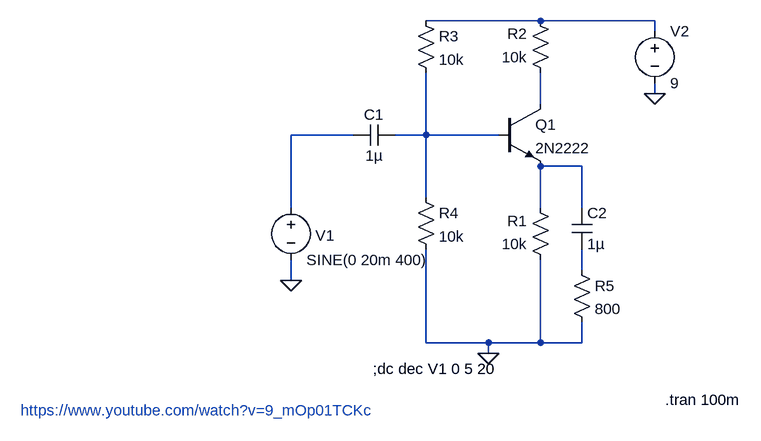
[diagram p0: schematic common_mode_emiter_amplifier.asc]
common_mode_emiter_amplifier.asc, the LTspice schematic file:
Version 4
SHEET 1 880 680
WIRE 304 -128 128 -128
WIRE 480 -128 304 -128
WIRE 480 -112 480 -128
WIRE 480 -16 480 -32
WIRE 304 0 304 -48
WIRE 16 48 -80 48
WIRE 128 48 128 -48
WIRE 128 48 80 48
WIRE 240 48 128 48
WIRE 368 96 304 96
WIRE 128 144 128 48
WIRE -80 160 -80 48
WIRE 304 160 304 96
WIRE 368 160 368 96
WIRE 368 256 368 224
WIRE -80 272 -80 240
WIRE 128 368 128 224
WIRE 224 368 128 368
WIRE 304 368 304 240
WIRE 304 368 224 368
WIRE 368 368 368 336
WIRE 368 368 304 368
WIRE 224 384 224 368
FLAG 224 384 0
FLAG 480 -16 0
FLAG -80 272 0
SYMBOL res 320 256 R180
WINDOW 0 36 76 Left 2
WINDOW 3 36 40 Left 2
SYMATTR InstName R1
SYMATTR Value 10k
SYMBOL res 320 -32 R180
WINDOW 0 36 76 Left 2
WINDOW 3 36 40 Left 2
SYMATTR InstName R2
SYMATTR Value 10k
SYMBOL npn 240 0 R0
SYMATTR InstName Q1
SYMATTR Value 2N2222
SYMBOL voltage -80 144 R0
WINDOW 0 38 59 Left 2
WINDOW 123 0 0 Left 2
WINDOW 39 0 0 Left 2
SYMATTR InstName V1
SYMATTR Value SINE(0 20m 400)
SYMBOL res 112 -144 R0
SYMATTR InstName R3
SYMATTR Value 10k
SYMBOL res 112 128 R0
SYMATTR InstName R4
SYMATTR Value 10k
SYMBOL cap 80 32 R90
WINDOW 0 0 32 VBottom 2
WINDOW 3 32 32 VTop 2
SYMATTR InstName C1
SYMATTR Value 1µ
SYMBOL cap 352 160 R0
SYMATTR InstName C2
SYMATTR Value 1µ
SYMBOL res 352 240 R0
SYMATTR InstName R5
SYMATTR Value 800
SYMBOL voltage 480 -128 R0
WINDOW 123 0 0 Left 2
WINDOW 39 0 0 Left 2
SYMATTR InstName V2
SYMATTR Value 9
TEXT 46 408 Left 2 !;dc dec V1 0 5 20
TEXT 496 456 Left 2 !.tran 100m
TEXT -496 472 Left 2 ;https://www.youtube.com/watch?v=9_mOp01TCKc

The netlist it stands for:
* common_mode_emiter_amplifier.asc
R1 0 N005 10k
R2 N002 N001 10k
Q1 N002 N004 N005 0 2N2222
V1 N003 0 SINE(0 20m 400)
R3 N001 N004 10k
R4 N004 0 10k
C1 N004 N003 1µ
C2 N005 N006 1µ
R5 N006 0 800
V2 N001 0 9
.model NPN NPN
.model PNP PNP
.lib standard.bjt
;dc dec V1 0 5 20
.tran 100m
* https://www.youtube.com/watch?v=9_mOp01TCKc
.backanno
.end